# EAGLE design Micromouse_controller_v002 (EAGLE 7.2.0)
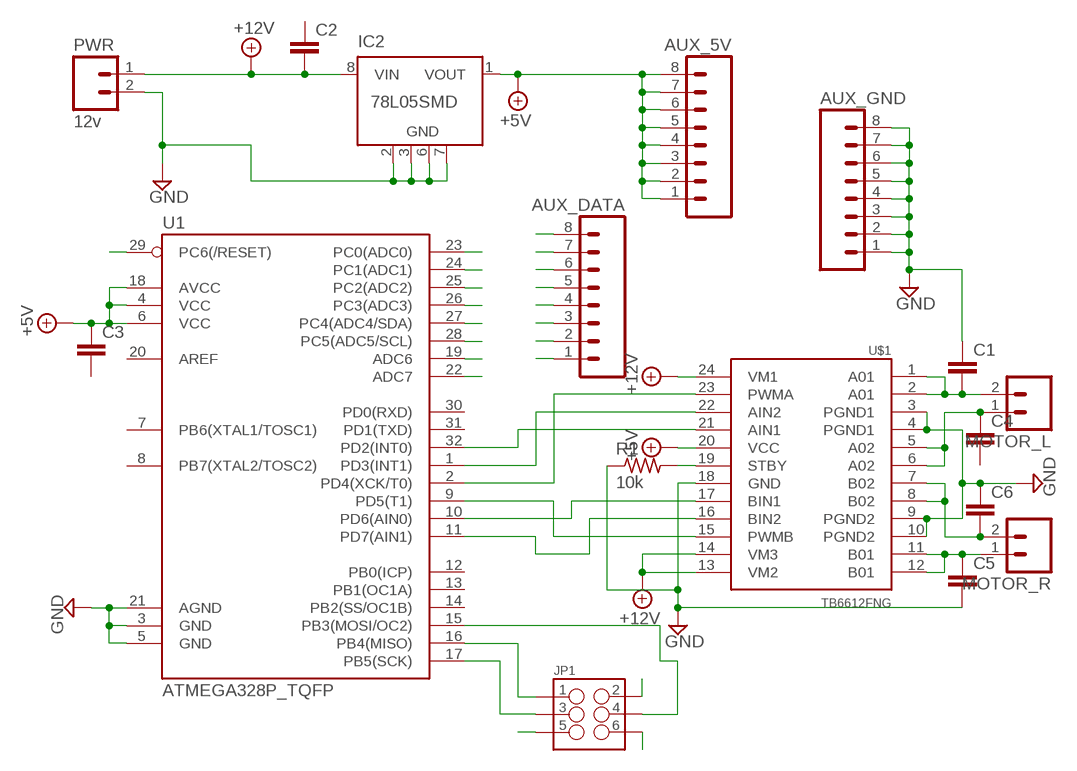
[diagram p0: schematic, sheet 1]

## Parts
AUX_5V  M08SMD-STRAIGHT-ALT-FEMALE  [1X08_SMD_ALT]
AUX_DATA  M08SMD-STRAIGHT-ALT-FEMALE  [1X08_SMD_ALT]
AUX_GND  M08SMD-STRAIGHT-ALT-FEMALE  [1X08_SMD_ALT]
C1  CAPSMD  [GRM43D]
C2  CAPSMD  [GRM43D]
C3  CAPSMD  [GRM43D]
C4  CAPSMD  [GRM43D]
C5  CAPSMD  [GRM43D]
C6  CAPSMD  [GRM43D]
IC2  78L05SMD  [SO08]
JP1  M03X2FEMALE_SMD  [2X3_SMD]
MOTOR_L  M02-JST-2MM-SMT  [JST-2-SMD]
MOTOR_R  M02-JST-2MM-SMT  [JST-2-SMD]
PWR  12v  M02-JST-2MM-SMT  [JST-2-SMD]
R1  10k  R-US_R0603  [R0603]
U1  ATMEGA328P_TQFP  [TQFP32-08]
U$1  TB6612FNG  [SSOP24]

## Nets
+5V: AUX_5V.1 AUX_5V.2 AUX_5V.3 AUX_5V.4 AUX_5V.5 AUX_5V.6 AUX_5V.7 AUX_5V.8 C3.A IC2.1(VOUT) JP1.2 U1.4(VCC) U1.6(VCC) U1.18(AVCC)
+12V: C2.C IC2.8(VIN) PWR.1 U$1.13(VM2) U$1.14(VM3)
ADC0: AUX_DATA.3 U1.23(PC0(ADC0))
ADC1: AUX_DATA.4 U1.24(PC1(ADC1))
ADC2: AUX_DATA.5 U1.25(PC2(ADC2))
ADC3: AUX_DATA.6 U1.26(PC3(ADC3))
ADC4: AUX_DATA.7 U1.27(PC4(ADC4/SDA))
ADC5: AUX_DATA.8 U1.28(PC5(ADC5/SCL))
ADC6: AUX_DATA.1 U1.19(ADC6)
ADC7: AUX_DATA.2 U1.22(ADC7)
AIN1_DRIVER: U1.32(PD2(INT0)) U$1.21(AIN1)
AIN2_DRIVER: U1.1(PD3(INT1)) U$1.22(AIN2)
BIN1_DRIVER: U1.10(PD6(AIN0)) U$1.17(BIN1)
BIN2_DRIVER: U1.11(PD7(AIN1)) U$1.16(BIN2)
GND: AUX_GND.1 AUX_GND.2 AUX_GND.3 AUX_GND.4 AUX_GND.5 AUX_GND.6 AUX_GND.7 AUX_GND.8 C1.A C5.C C6.A IC2.2(GND) IC2.3(GND) IC2.6(GND) IC2.7(GND) JP1.6 PWR.2 R1.1 U1.3(GND) U1.5(GND) U1.21(AGND) U$1.3(PGND1) U$1.4(PGND1) U$1.9(PGND2) U$1.10(PGND2) U$1.18(GND)
N$11: C1.C MOTOR_L.2 U$1.1(A01) U$1.2(A01)
N$12: C4.A MOTOR_L.1 U$1.5(A02) U$1.6(A02)
N$13: C5.A MOTOR_R.1 U$1.11(B01) U$1.12(B01)
N$14: C6.C MOTOR_R.2 U$1.7(B02) U$1.8(B02)
N$17: JP1.1 U1.16(PB4(MISO))
N$18: JP1.3 U1.17(PB5(SCK))
N$22: JP1.4 U1.15(PB3(MOSI/OC2))
PWMA_DRIVER: U1.2(PD4(XCK/T0)) U$1.23(PWMA)
PWMB_DRIVER: U1.9(PD5(T1)) U$1.15(PWMB)
RST: JP1.5 U1.29(PC6(/RESET))
STBY: R1.2 U$1.19(STBY)
VCC_DRIVER: U$1.20(VCC) ; supply symbol labelled +5V
VM1_DRIVER: U$1.24(VM1) ; supply symbol labelled +12V
Unconnected: C2.A C3.C C4.C IC2.4(NC) IC2.5(NC) U1.7(PB6(XTAL1/TOSC1)) U1.8(PB7(XTAL2/TOSC2)) U1.12(PB0(ICP)) U1.13(PB1(OC1A)) U1.14(PB2(SS/OC1B)) U1.20(AREF) U1.30(PD0(RXD)) U1.31(PD1(TXD))

## Library data of the parts
AUX_5V AUX_DATA AUX_GND = SparkFun-Connectors:M08: Header 8 Standard 8-pin 0.1" header. Use with straight break away headers (SKU : PRT-00116), right angle break away headers (PRT-00553), swiss pins (PRT-00743), machine pins (PRT-00117), and female headers (PRT-00115).; PROD_ID: CONN-10204
C1-C6 = SparkFun-Capacitors:CAP: Capacitor Standard 0603 ceramic capacitor, and 0.1" leaded capacitor.
IC2 = linear:78L*SMD: Positive VOLTAGE REGULATOR
JP1 = SparkFun-Connectors:M03X2: 2x3 .1" header. Shrouded, with keying- CONN-10681 SMT- CONN-11415 Pogo pins- HW-11044; PROD_ID: CONN-11290
MOTOR_L MOTOR_R PWR = SparkFun-Connectors:M02: Standard 2-pin 0.1" header. Use with - straight break away headers ( PRT-00116) - right angle break away headers (PRT-00553) - swiss pins (PRT-00743) - machine pins (PRT-00117) - female headers (PRT-00115) Molex polarized connector foot print use with: PRT-08233 with associated crimp pins and housings. 2.54_SCREWTERM for use with PRT-10571. 3.5mm Screw Terminal footprints for PRT-08084 5mm Screw Terminal footprints for use with PRT-08432; PROD_ID: CONN-11443
R1 = resistor:R-US_: RESISTOR, American symbol
U1 = SparkFun-DigitalIC:ATMEGA328P_TQFP; PROD_ID: IC-09069
U$1 = SparkFun-PowerIC:TB6612FNG: Toshiba 1A dual motor driver IC-09363; PROD_ID: IC-09363

## Board
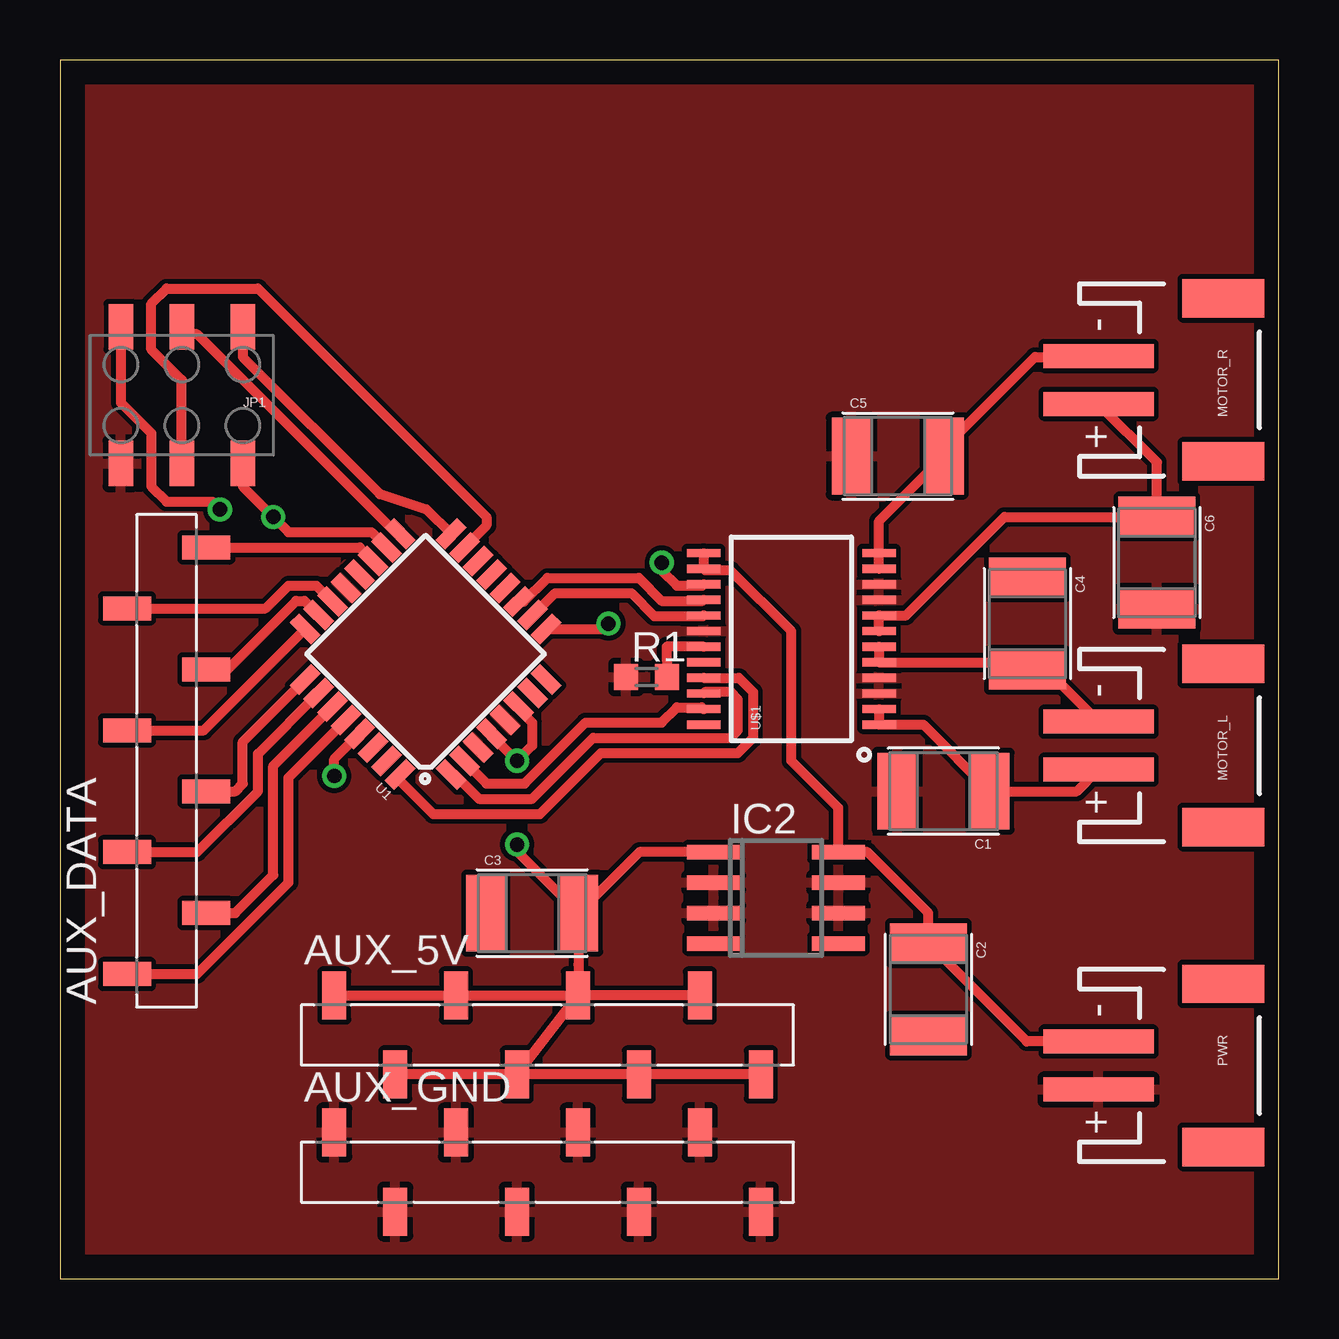
[diagram p1: board, top side]
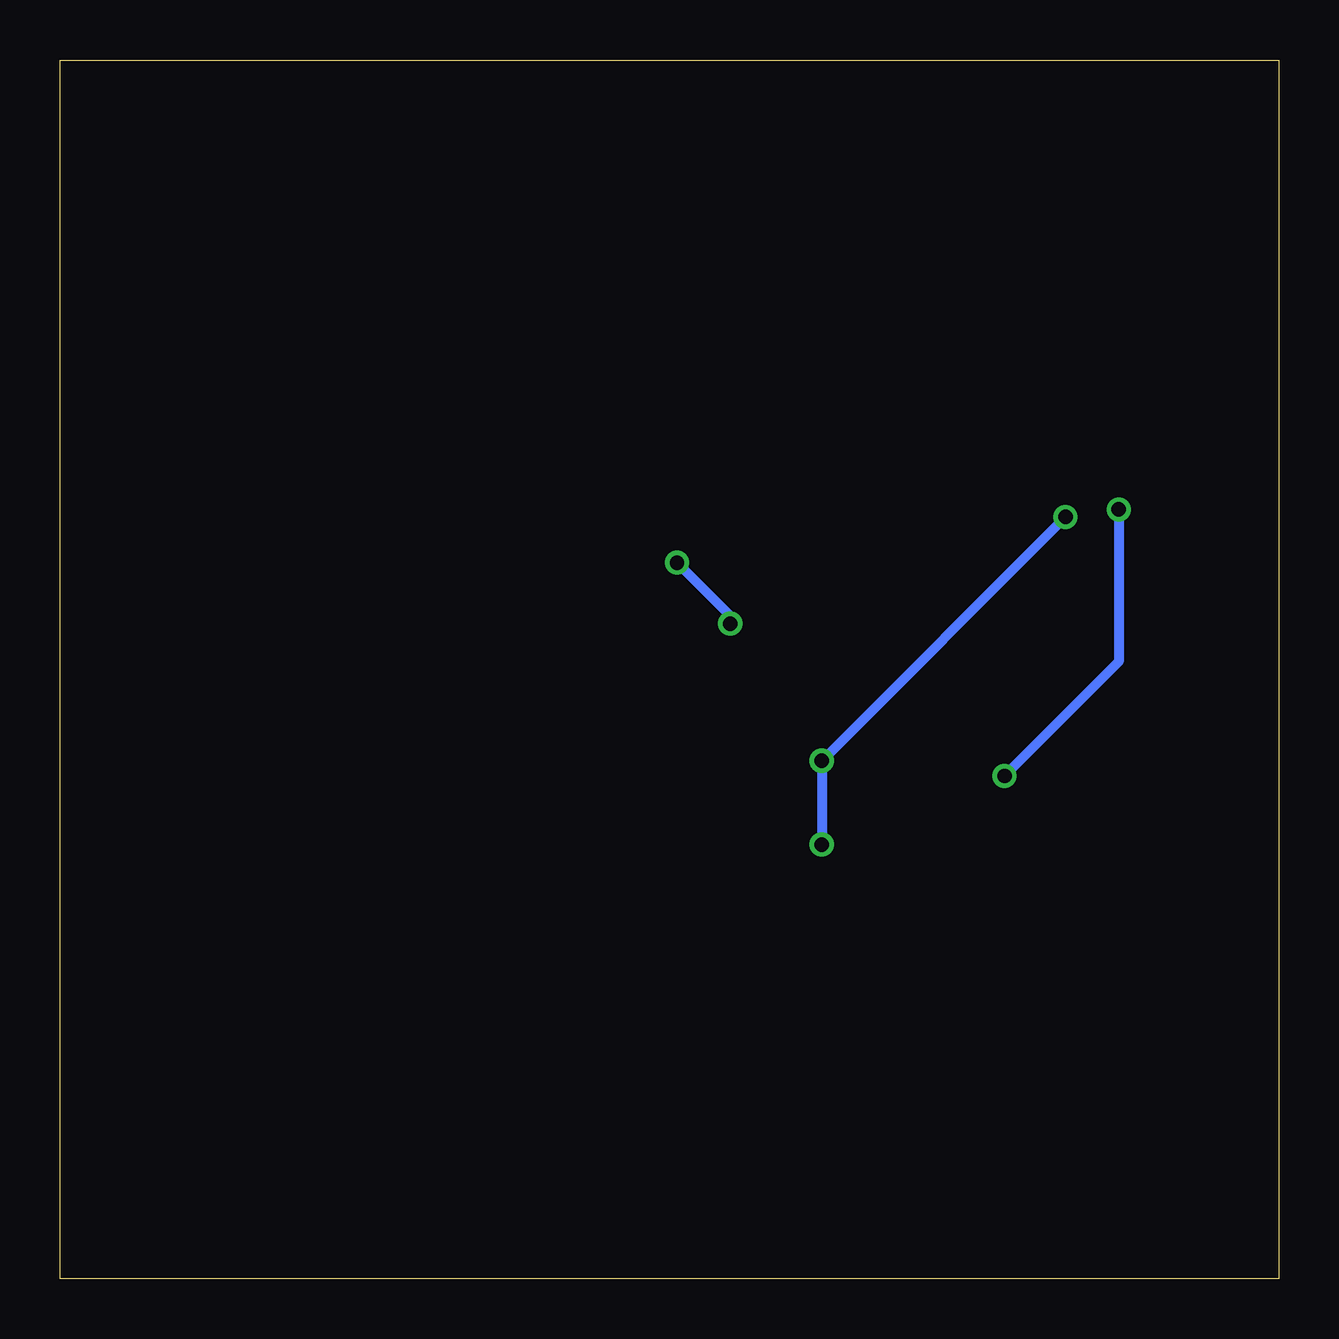
[diagram p2: board, bottom side, seen from below]

Size 50.8 x 50.8 mm. Coordinates in mm from the lower left corner, seen from the top.
Outline: 0,0 50.8,0 50.8,50.8 0,50.8 0,0
Copper layers (1*16): Top 0.035mm / dielectric 1.5mm / Bottom 0.035mm
Design rules "default": minimum track width 10mil, minimum drill 24mil, track to track 8mil, track to pad 8mil, pad to pad 8mil, via to via 8mil, smd to smd 8mil, copper to edge 40mil, drill to drill 8mil, minimum pad ring 10mil, minimum via ring 8mil, stop-mask expansion 4mil, vias tented up to drill 0mil, thermal gap 10mil

### Footprints (pad centres in the part's own frame; a part is rotated, then mirrored left to right if it is on the bottom)
1X08_SMD_ALT = smd 1 x 2: 1 0,-1.65; 2 -2.54,1.65; 3 -5.08,-1.65; 4 -7.62,1.65; 5 -10.16,-1.65; 6 -12.7,1.65; 7 -15.24,-1.65; 8 -17.78,1.65
GRM43D = smd 1.65 x 3.2: A 1.927,0; C -1.927,0
SO08 = smd 0.6 x 2.2: 1 -1.905,-2.6; 2 -0.635,-2.6; 3 0.635,-2.6; 4 1.905,-2.6; 5 1.905,2.6; 6 0.635,2.6; 7 -0.635,2.6; 8 -1.905,2.6
2X3_SMD = smd 1.02 x 1.9: 1 -2.54,-2.85; 2 -2.54,2.85; 3 0,-2.85; 4 0,2.85; 5 2.54,-2.85; 6 2.54,2.85
JST-2-SMD = smd 1 x 4.6: 1 -1,-3.7; 2 1,-3.7 | smd 1.6 x 3.4: NC1 -3.4,1.5; NC2 3.4,1.5
R0603 = smd 1 x 1.1: 1 -0.85,0; 2 0.85,0
TQFP32-08 = smd 1.27 x 0.559: 1 -4.293,2.8; 2 -4.293,2; 3 -4.293,1.2; 4 -4.293,0.4; 5 -4.293,-0.4; 6 -4.293,-1.2; 7 -4.293,-2; 8 -4.293,-2.8; 17 4.293,-2.8; 18 4.293,-2; 19 4.293,-1.2; 20 4.293,-0.4; 21 4.293,0.4; 22 4.293,1.2; 23 4.293,2; 24 4.293,2.8 | smd 0.559 x 1.27: 9 -2.8,-4.293; 10 -2,-4.293; 11 -1.2,-4.293; 12 -0.4,-4.293; 13 0.4,-4.293; 14 1.2,-4.293; 15 2,-4.293; 16 2.8,-4.293; 25 2.8,4.293; 26 2,4.293; 27 1.2,4.293; 28 0.4,4.293; 29 -0.4,4.293; 30 -1.2,4.293; 31 -2,4.293; 32 -2.8,4.293
SSOP24 = smd 0.348 x 1.397: 1 -3.575,-3.656; 2 -2.925,-3.656; 3 -2.275,-3.656; 4 -1.625,-3.656; 5 -0.975,-3.656; 6 -0.325,-3.656; 7 0.325,-3.656; 8 0.975,-3.656; 9 1.625,-3.656; 10 2.275,-3.656; 11 2.925,-3.656; 12 3.575,-3.656; 13 3.575,3.656; 14 2.925,3.656; 15 2.275,3.656; 16 1.625,3.656; 17 0.975,3.656; 18 0.325,3.656; 19 -0.325,3.656; 20 -0.975,3.656; 21 -1.625,3.656; 22 -2.275,3.656; 23 -2.925,3.656; 24 -3.575,3.656

### Placement (x,y rotation side)
AUX_5V  29.21,10.16 0 top
AUX_DATA  4.45,30.48 90 top
AUX_GND  29.21,4.45 0 top
C1  36.83,20.32 180 top
C2  36.2,12.06 270 top
C3  19.68,15.24 0 top
C4  40.32,27.3 270 top
C5  34.92,34.29 0 top
C6  45.72,29.84 270 top
IC2  29.84,15.88 270 top
JP1  5.08,36.83 180 top
MOTOR_L  46.99,22.23 270 top
MOTOR_R  46.99,37.47 270 top
PWR  46.99,8.89 270 top
R1  24.45,25.08 0 top
U1  15.24,26.04 135 top
U$1  30.48,26.67 90 top

### Tracks (layer width: path | path; a pad name or v marks a point on that pad's centre or on a via)
+5V  (via drill 0.6)
  Top 0.406: U1.4 17.99,22.65 v19.05,21.59 19.68,22.23 19.68,23.18 19.12,23.74 U1.6 | v19.05,18.1 19.05,17.8 C3.A | IC2.1 24.15,17.78 C3.A | C3.A 21.61,13.1 AUX_5V.4 | AUX_5V.1 AUX_5V.3 AUX_5V.5 | AUX_5V.5 AUX_5V.7 | AUX_5V.5 AUX_5V.4 | AUX_5V.8 AUX_5V.6 AUX_5V.4 | AUX_5V.2 AUX_5V.4 | JP1.2 7.62,33.02 v8.89,31.75 9.53,31.11 12.99,31.11 U1.18
  Bottom 0.406: v19.05,18.1 v19.05,21.59 v8.89,31.75
+12V
  Top 0.406: U$1.13 U$1.14 26.89,29.53 27.94,29.53 30.48,26.99 30.48,21.59 32.45,19.62 IC2.8 33.66,17.78 36.2,15.24 C2.C 40.3,9.89 PWR.1
ADC0
  Top 0.406: AUX_DATA.3 6.99,25.4 9.84,28.26 10.19,28.26 U1.23
ADC1
  Top 0.406: AUX_DATA.4 5.99,22.86 U1.24
ADC2
  Top 0.406: AUX_DATA.5 7.3,20.32 7.62,20.64 7.62,22.38 U1.25
ADC3
  Top 0.406: AUX_DATA.6 5.71,17.78 8.26,20.32 8.26,21.88 U1.26
ADC4
  Top 0.406: AUX_DATA.7 7.3,15.24 8.89,16.83 8.89,21.38 U1.27
ADC5
  Top 0.406: AUX_DATA.8 5.71,12.7 9.53,16.51 9.53,20.89 U1.28
ADC6
  Top 0.406: AUX_DATA.1 12.49,30.48 U1.19
ADC7
  Top 0.406: AUX_DATA.2 8.57,27.94 9.53,28.89 10.69,28.89 U1.22
AIN1_DRIVER
  Top 0.406: U1.32 14.19,20.74 15.56,19.37 20,19.37 22.54,21.91 28.26,21.91 28.89,22.54 28.89,24.45 28.3,25.05 U$1.21
AIN2_DRIVER
  Top 0.406: U1.1 16.45,21.02 17.46,20 19.68,20 22.23,22.54 27.94,22.54 28.26,22.86 28.26,24.13 27.94,24.45 26.88,24.45 U$1.22
BIN1_DRIVER
  Top 0.406: U1.10 19.72,27.66 20.64,28.57 23.81,28.57 24.77,27.62 26.8,27.62 U$1.17
BIN2_DRIVER
  Top 0.406: U1.11 19.33,28.22 20.32,29.21 24.13,29.21 25.08,28.26 26.79,28.26 U$1.16
GND
  pour Top: -2.54,53.98 54.61,53.98 55.88,-3.81 -2.54,-3.81
N$1  (via drill 0.6)
  other vias: 19.05,21.59
N$2  (via drill 0.6)
  other vias: 19.05,18.1
N$3  (via drill 0.6)
  other vias: 8.89,31.75
N$5  (via drill 0.6)
  other vias: 25.08,29.84
N$6  (via drill 0.6)
  other vias: 6.67,32.07
N$7  (via drill 0.6)
  other vias: 11.43,20.95
N$11
  Top 0.406: U$1.2 U$1.1 35.98,23.09 C1.C 42.38,20.32 MOTOR_L.2
N$12
  Top 0.406: U$1.6 U$1.5 39.69,25.7 C4.A 41.14,25.38 MOTOR_L.1
N$13
  Top 0.406: U$1.11 U$1.12 34.14,31.57 C5.A 36.85,34.63 40.64,38.42 43.24,38.42 MOTOR_R.1
N$14
  Top 0.406: U$1.7 U$1.8 35.27,27.64 39.37,31.75 45.7,31.75 C6.C 45.72,34.03 MOTOR_R.2
N$17
  Top 0.406: JP1.1 7.62,38.42 13.34,32.7 15.28,32.07 U1.16
N$18
  Top 0.406: U1.17 14.04,31.05 5.71,39.37 5.39,39.37 JP1.3
N$22
  Top 0.406: JP1.4 5.08,37.47 3.81,38.73 3.81,40.64 4.45,41.27 8.26,41.27 17.78,31.75 17.78,31.4 U1.15
PWMA_DRIVER
  Top 0.406: U1.2 16.86,21.56 17.78,20.64 19.37,20.64 21.91,23.18 25.08,23.18 25.72,23.81 26.76,23.81 U$1.23
PWMB_DRIVER  (via drill 0.6)
  Top 0.406: U1.9 22.64,27.09 v22.86,27.3 | v25.08,29.84 25.08,29.53 25.72,28.89 26.77,28.89 U$1.15
  Bottom 0.406: v22.86,27.3 22.86,27.62 v25.08,29.84
RST  (via drill 0.6)
  Top 0.406: JP1.5 2.54,36.51 3.81,35.24 3.81,33.02 4.45,32.38 6.35,32.38 v6.67,32.07 | v11.43,20.95 11.43,21.66 U1.29
  Bottom 0.406: v6.67,32.07 6.67,25.72 v11.43,20.95
STBY
  Top 0.406: U$1.19 25.29,26.34 R1.2